# Altium schematic sheet Power.SchDoc
size 431 x 279 mm; SheetNumber: 2; SheetTotal: 7
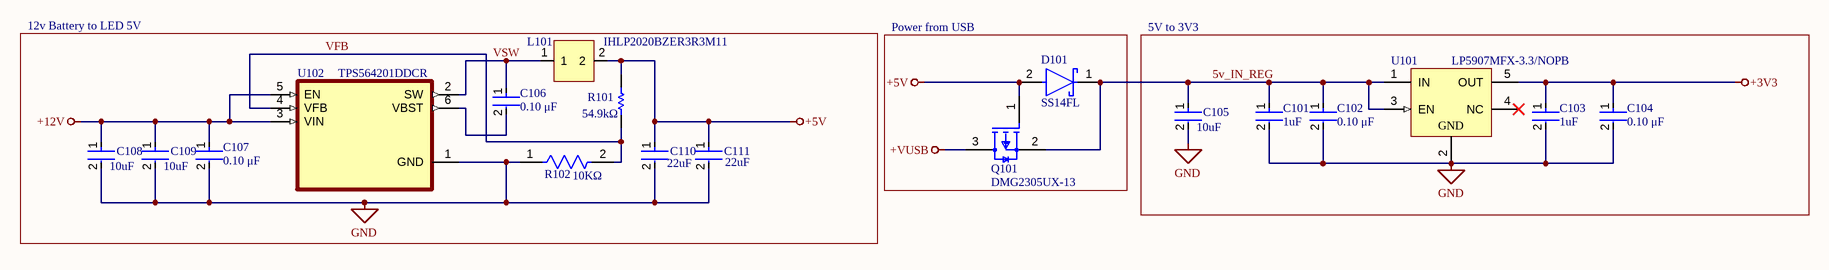
[diagram p0: Power.SchDoc]

## Parts
C101  Capacitance: 1uF  [FP-C0603C-CJ-MFG]  (hidden comment: C0603C105K4RACAUTO)
C102  Capacitance: 0.10 μF  [FP-C0603C-CF-MFG]  (hidden comment: C0603C104K5RACAUTO)
C103  Capacitance: 1uF  [FP-C0603C-CJ-MFG]  (hidden comment: C0603C105K4RACAUTO)
C104  Capacitance: 0.10 μF  [FP-C0603C-CF-MFG]  (hidden comment: C0603C104K5RACAUTO)
C105  Capacitance: 10uF  [FP-GRM31C-0_2-e0_3_0_8-MFG]  (hidden comment: GRM31CR71E106KA12K)
C106  Capacitance: 0.10 μF  [FP-C0603C-CF-MFG]  (hidden comment: C0603C104K5RACAUTO)
C107  Capacitance: 0.10 μF  [FP-C0603C-CF-MFG]  (hidden comment: C0603C104K5RACAUTO)
C108  Capacitance: 10uF  [FP-GRM31C-0_2-e0_3_0_8-MFG]  (hidden comment: GRM31CR71E106KA12K)
C109  Capacitance: 10uF  [FP-GRM31C-0_2-e0_3_0_8-MFG]  (hidden comment: GRM31CR71E106KA12K)
C110  value 22uF  [FP-CL31H-0_2-MFG]  (hidden comment: CL31A226KAHNNNE)
C111  value 22uF  [FP-CL31H-0_2-MFG]  (hidden comment: CL31A226KAHNNNE)
D101  SS14FL  [FP-425AD-MFG]
L101  IHLP2020BZER3R3M11  [IHLP2020BZER3R3M11]
Q101  DMG2305UX-13  [FP-SOT23-MFG]
R101  value 54.9kΩ  [RESC1608X55X30LL15T15]  (hidden comment: ERJ-3EKF5492V)
R102  Resistance: 10KΩ  [FP-AC0603-MFG]  (hidden comment: AC0603FR-0710KL)
U101  LP5907MFX-3.3/NOPB  [DBV0005A_N]
U102  TPS564201DDCR  [SOT95P280X110-6N]

## Blocks framed on the sheet
12v Battery to LED 5V: C106-C111 L101 R101 R102 U102
Power from USB: D101 Q101
5V to 3V3: C101-C105 U101

## Nets
+3V3: C103.1 C104.1 U101.5(OUT)
+5V: C110.1 C111.1 D101.2(A) L101.2 Q101.1(G) R101.2
+12V: C107.1 C108.1 C109.1 U102.3(VIN) U102.5(EN)
+VUSB: Q101.3(D)
GND: C101.2 C102.2 C103.2 C104.2 C105.2 C107.2 C108.2 C109.2 C110.2 C111.2 R102.1 U101.2(GND) U102.1(GND)
5v_IN_REG: C101.1 C102.1 C105.1 D101.1(C) Q101.2(S) U101.1(IN) U101.3(EN)
VFB: R101.1 R102.2 U102.4(VFB)
VSW: C106.1 L101.1 U102.2(SW)
NetC106_2: C106.2 U102.6(VBST)

Not connected (* = marked no-connect by the designer): U101 4(NC)*

## Notes on the sheet
- DWG. NO.
- REV.
- SHT.
- THIS DOCUMENT AND THE DATA DISCLOSED HEREIN OR HEREWITH IS THE PROPERTY OF ALTIUM LIMITED AND MAY BE FREELY DISTRIBUTED IN WHOLE. NO RIGHTS ARE RESERVED OR EXPRESS OR IMPLIED WARANTEE GIVEN.
- REVISION
- DESCRIPTION
- DATE
- APPROVED
- ENG:
- APPROVALS
- PROJECT
- DSN:
- CHK:
- REFERENCE DOCUMENTS
- PROJECT REVISION:
- TITLE
- DOCUMENT REVISION:
- DESIGN ITEM:
- BOM:
- FAB DWG:
- PCB DWG:
- ASSY DWG:
- SCALE:
- SIZE
- B
- CAGE CODE
- FILE NAME
- DWG NO.
- SHEET
- OF
- REV

## Library data of the parts
C101 C103 = CMP-03020-014193-1: CAP CER 0603 1UF 16V X7R 10%; Manufacturer: KEMET; Temperature Coefficient: 15%; Automotive Grade: Grade 1; Material: Ceramic; Digikey Description: CAP CER 0603 1UF 16V X7R 10%; Octopart: https://octopart.com/c0603c105k4racauto-kemet-91328491; Package: C0603C-CJ; ComponentLink2Description: Datasheet; Mouser Description: Cap Ceramic 1uF 16V X7R 10% Pad SMD 0603 125C Automotive T/R; Automotive: Yes; Tolerance: 10%; Manufacturer Part Number: C0603C105K4RACAUTO; Lead Free: Yes; Temperature: -55°C to +125°C; ComponentLink2URL: https://content.kemet.com/datasheets/KEM_C1023_X7R_AUTO_SMD.pdf; Temperature Range Low: -55°C; Ipc Land Pattern Name: CAPC16080X80; Device Class L1: Passive Components; Temperature Characteristic: X7R; Device Class L2: Capacitors; Height: 0.95mm; Device Class L3: Ceramic Capacitors; RoHS: TRUE; Category: Cap; Temperature Range High: +125°C; Value: 1uF; Voltage Rating: 16V
C102 C104 C106 C107 = CMP-2006-03060-2: CAP CER 0.1UF 50V X7R 0603; Manufacturer: KEMET; Tolerance: 0.1; Material: Ceramic; Value: 0.10 μF; Automotive Grade: Grade 1; Temperature Coefficient: 30ppm/°C; RoHS: TRUE; Temperature Range Low: -55°C; Automotive: Yes; Octopart: https://octopart.com/c0603c104k5racauto-kemet-12563741; Temperature Characteristic: X7R; Category: Cap; Voltage Rating: 50 V; Mouser Description: Multilayer Ceramic Capacitors MLCC - SMD/SMT 0.1uF 50volts 10% X7R AUTO; ComponentLink2Description: Datasheet; Device Class L2: Capacitors; Digikey Description: CAP CER 0.1UF 50V X7R 0603; Manufacturer Part Number: C0603C104K5RACAUTO; ComponentLink2URL: https://api.kemet.com/component-edge/download/datasheet/C0603C100J5GACAUTO.pdf; Lead Free: Yes; Height: 0.87mm; Device Class L3: Ceramic Capacitors; Device Class L1: Passive Components; Temperature Range High: +125°C; Package: C0603C-CF; Temperature: -55°C to +125°C
C105 C108 C109 = CMP-06035-005515-1: Chip Multilayer Ceramic Capacitors for General Purpose, 1206, 10uF, X7R, 15%, 10%, 25V; Dielectric: X7R; Max Operating Temperature: 125°C; Voltage Rating (DC): 25V; Case/Package: 1206; Thickness: 0.071inch; Tolerance: 10%; Voltage Rating: 25V; Mount: Surface Mount; Width: 0.063inch; Length: 0.126inch; Min Operating Temperature: -55°C; Packaging: Tape and Reel; Lead Free: Lead Free; Voltage: 25V
C110 C111 = CMP-13271-000012-1: CAP CER 22UF 25V X5R 1206; Manufacturer: Samsung; Temperature Coefficient: 15%; Tolerance: 10%; Material: Ceramic; Automotive: No; Device Class L3: Ceramic Capacitors; Temperature: -55°C to +85°C; Octopart: https://octopart.com/cl31a226kahnnne-samsung-19832795; Temperature Range Low: -55°C; Voltage Rating: 25V; Height: 1.8mm; Temperature Characteristic: X5R; Package: CL31H-0.2; Temperature Range High: +85°C; ComponentLink2URL: http://www.samsungsem.com/kr/support/product-search/mlcc/__icsFiles/afieldfile/2019/05/10/19-CL31A226KAHNNNE.pdf; Ipc Land Pattern Name: CAPC320160X160; Lead Free: Yes; Device Class L2: Capacitors; Device Class L1: Passive Components; Capacitance: 22uF; Digikey Description: CAP CER 22UF 25V X5R 1206; Manufacturer Part Number: CL31A226KAHNNNE; RoHS: TRUE; Category: Cap; ComponentLink2Description: Datasheet
D101 = CMP-07162-000013-1: DIODE SCHOTTKY 40V 1A SOD123F; Manufacturer: ON Semiconductor; Max Junction Temp: +125°C; Value: 60pF; Max Surge Forward Current: 40A; Peak Reverse Current: 30uA; Device Class L3: Schottky Diodes; Reverse Voltage: 40V; Automotive: No; Temperature: -55°C to +125°C; Mouser Description: SS14FL Series 40 V 1 A Surface Mount Schottky Barrier Rectifier - SOD-123F; Octopart: https://octopart.com/ss14fl-on+semiconductor-84331601; Height: 1.08mm; Temperature Range Low: -55°C; Category: Diode; Lead Free: Yes; Device Class L1: Discrete Semiconductors; Digikey Description: DIODE SCHOTTKY 40V 1A SOD123F; RoHS: TRUE; ComponentLink2Description: Datasheet; Manufacturer Part Number: SS14FL; Forward Current: 1A; Capacitance: 60pF; Package: 425AD; Device Class L2: Diodes; Temperature Range High: +125°C; Max Repetitive Reverse Voltage: 40V; ComponentLink2URL: https://www.onsemi.com/pub/Collateral/SS14FL-D.PDF
Q101 = CMP-12801-000021-1: MOSFET P-CH 20V 4.2A SOT23; Manufacturer: Diodes Inc.; Input Capacitace At Vds: 808pF @ -15V; Rthja Max: 90°C/W; Drain To Source Voltage: -20V; Standoff Height: 0.013mm; Number Of P Channels: 1; Gate To Source Voltage: 8V; Turn On Delay Time: 10.8ns; Pulse Drain Current: -15A; Threshold Vgs Max: -0.9V; Max Junction Temp: +150°C; Depletion Mode: False; Drain To Source Resistance: 40mΩ; Threshold Vgs Min: -0.5V; Continuous Drain Current: -4.2A; Turn Off Delay Time: 79.3ns; Gate Charge At Vgs: 10.2nC @ -4.5V; Power Dissipation: 1.4W; Digikey Description: MOSFET P-CH 20V 4.2A SOT23; Temperature Range High: +150°C; Height: 1.1mm; Package: SOT23; Footprint Url: https://www.diodes.com/assets/Package-Files/SOT23.pdf; Device Class L3: MOSFETs; RoHS: TRUE; Temperature: -55°C to +150°C; Mouser Description: MOSFET P-Ch ENH FET -20V 52mOhm -5.0V; Temperature Range Low: -55°C; ComponentLink2Description: Datasheet; Manufacturer Part Number: DMG2305UX-13; Octopart: https://octopart.com/dmg2305ux-13-diodes+inc.-29925594; Ipc Land Pattern Name: SOT92P240X102-3; Device Class L2: Transistors; Automotive: No; Number Of Channels: 1; Drain To Source Breakdown Voltage: -20V; Lead Free: Yes; Device Class L1: Discrete Semiconductors; Category: Trans; ComponentLink2URL: https://www.diodes.com/assets/Datasheets/DMG2305UX.pdf
R101 = CMP-2000-00561-1: Manufacturer: Panasonic; Part Number: ERJ-3EKF5492V
R102 = CMP-2000-04818-2: RES SMD 10K OHM 1% 1/10W 0603; Manufacturer: Yageo; Value: 10KΩ; Automotive Grade: Grade 0; Tolerance: 0.01; Power Rating: 0.1W; Voltage Rating: 75V; Automotive: Yes; Device Class L2: Resistors; Device Class L1: Passive Components; Footprint Url: http://www.yageo.com/exep/pages/download/literatures/PYu-R_Mount_9.pdf; Temperature Range High: +155°C; Composition: Thick Film; Height: 0.55mm; Series: AC; Mouser Description: Fixed Resistor, Metal Glaze/thick Film, 0.1W, 10000ohm, 50V, 1% +/-Tol, 100ppm/Cel, Surface Mount, 0603; RoHS: TRUE; Manufacturer Part Number: AC0603FR-0710KL; Lead Free: Yes; Package: AC0603; Ipc Land Pattern Name: RESC16080X45; Octopart: https://octopart.com/ac0603fr-0710kl-yageo-21711091; ComponentLink2URL: http://www.yageo.com/NewPortal/yageodocoutput?fileName=/pdf/R-Chip/PYu-AC_51_RoHS_L_6.pdf; Digikey Description: RES SMD 10K OHM 1% 1/10W 0603; Temperature Range Low: -55°C; Temperature: -55°C to +155°C; ComponentLink2Description: Datasheet; Category: Res; Device Class L3: Chip SMD Resistors
U101 = CMP-2000-07464-2: None; Power Supply Rejection Ratio (PSRR): 82dB; Accuracy: 2%; Output Type: Fixed; Min Input Voltage: 2.2V; Quiescent Current: 425uA; Max Output Current: 250mA; Output Voltage: 3.3V; Number of Outputs: 1; Polarity: Positive; Max Input Voltage: 5.5V; Dropout Voltage: 250mV; Output Voltage Accuracy: 2%; RoHS Compliant: Yes; Max Operating Temperature: 125°C; Contact Plating: Tin; Number of Pins: 5; Lead Free: Lead Free; Radiation Hardening: No; Mount: Surface Mount; Nominal Output Voltage: 3.3V; Case/Package: SOT-23; Packaging: Tape and Reel; Number of Regulators: 1; Min Operating Temperature: -40°C; Package Quantity: 3000; REACH SVHC: No SVHC; Output Current: 250mA
U102 = TPS564201DDCR: MF: {'manufacturer': u'Texas Instruments'}; Package: None; MP: TPS564201DDCR; Value: *; Availability: Unavailable; Price: None
L101 = IHLP2020BZER3R3M11: Supplier 1: Mouser; Supplier Part Number 1: 70-IHLP2020BZER3R3M1